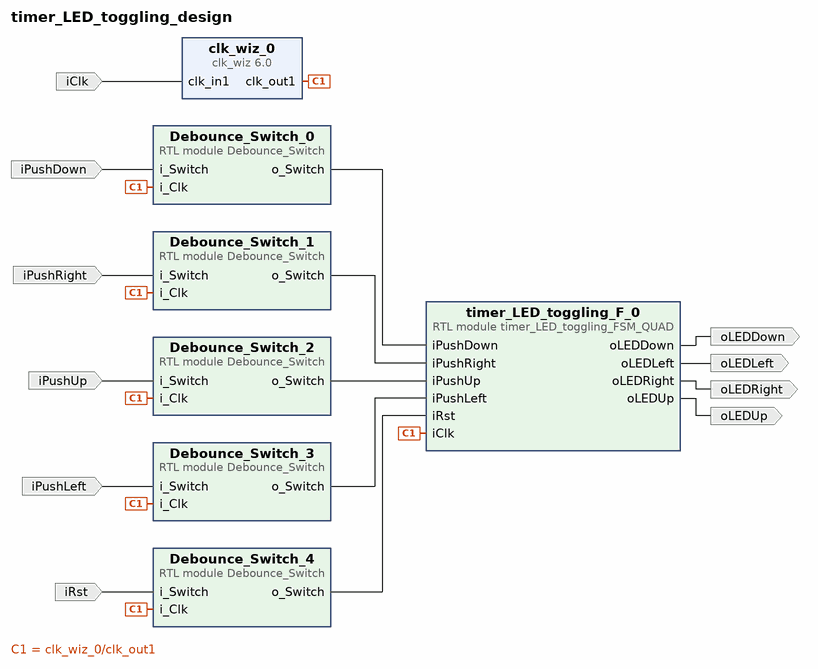
[diagram p0: block diagram of the top level]
# Vivado block design timer_LED_toggling_design, xc7z020clg400-1, Vivado 2025.1
create_bd_design timer_LED_toggling_design

create_bd_port -dir I -type clk iClk
create_bd_port -dir I iPushDown
create_bd_port -dir I iRst
create_bd_port -dir I iPushUp
create_bd_port -dir I iPushRight
create_bd_port -dir I iPushLeft
create_bd_port -dir O oLEDUp
create_bd_port -dir O oLEDDown
create_bd_port -dir O oLEDLeft
create_bd_port -dir O oLEDRight

create_bd_cell -type ip -vlnv xilinx.com:ip:clk_wiz:6.0 clk_wiz_0
set_property -dict [list \
  CONFIG.CLKIN1_JITTER_PS 80.0 \
  CONFIG.CLKOUT1_JITTER 312.659 \
  CONFIG.CLKOUT1_PHASE_ERROR 245.713 \
  CONFIG.CLKOUT1_REQUESTED_OUT_FREQ 25 \
  CONFIG.CLK_IN1_BOARD_INTERFACE sys_clock \
  CONFIG.MMCM_CLKFBOUT_MULT_F 36.500 \
  CONFIG.MMCM_CLKIN1_PERIOD 8.000 \
  CONFIG.MMCM_CLKOUT0_DIVIDE_F 36.500 \
  CONFIG.MMCM_DIVCLK_DIVIDE 5 \
  CONFIG.USE_LOCKED false \
  CONFIG.USE_RESET false \
] [get_bd_cells clk_wiz_0]
create_bd_cell -type module -reference Debounce_Switch Debounce_Switch_0
create_bd_cell -type module -reference Debounce_Switch Debounce_Switch_1
create_bd_cell -type module -reference Debounce_Switch Debounce_Switch_2
create_bd_cell -type module -reference Debounce_Switch Debounce_Switch_3
create_bd_cell -type module -reference timer_LED_toggling_FSM_QUAD timer_LED_toggling_F_0
create_bd_cell -type module -reference Debounce_Switch Debounce_Switch_4

# ---- connections ----

connect_bd_net [get_bd_pins Debounce_Switch_0/o_Switch] [get_bd_pins timer_LED_toggling_F_0/iPushDown]
connect_bd_net [get_bd_pins Debounce_Switch_1/o_Switch] [get_bd_pins timer_LED_toggling_F_0/iPushRight]
connect_bd_net [get_bd_pins Debounce_Switch_2/o_Switch] [get_bd_pins timer_LED_toggling_F_0/iPushUp]
connect_bd_net [get_bd_pins Debounce_Switch_3/o_Switch] [get_bd_pins timer_LED_toggling_F_0/iPushLeft]
connect_bd_net [get_bd_pins Debounce_Switch_4/o_Switch] [get_bd_pins timer_LED_toggling_F_0/iRst]
connect_bd_net [get_bd_pins clk_wiz_0/clk_out1] \
  [get_bd_pins Debounce_Switch_0/i_Clk] [get_bd_pins Debounce_Switch_1/i_Clk] [get_bd_pins Debounce_Switch_2/i_Clk] \
  [get_bd_pins Debounce_Switch_3/i_Clk] [get_bd_pins Debounce_Switch_4/i_Clk] [get_bd_pins timer_LED_toggling_F_0/iClk]
connect_bd_net [get_bd_ports iClk] [get_bd_pins clk_wiz_0/clk_in1]
connect_bd_net [get_bd_ports iRst] [get_bd_pins Debounce_Switch_4/i_Switch]
connect_bd_net -net i_Switch_0_1 [get_bd_ports iPushDown] [get_bd_pins Debounce_Switch_0/i_Switch]
connect_bd_net -net i_Switch_1_1 [get_bd_ports iPushUp] [get_bd_pins Debounce_Switch_2/i_Switch]
connect_bd_net -net i_Switch_2_1 [get_bd_ports iPushRight] [get_bd_pins Debounce_Switch_1/i_Switch]
connect_bd_net -net i_Switch_3_1 [get_bd_ports iPushLeft] [get_bd_pins Debounce_Switch_3/i_Switch]
connect_bd_net [get_bd_pins timer_LED_toggling_F_0/oLEDDown] [get_bd_ports oLEDDown]
connect_bd_net [get_bd_pins timer_LED_toggling_F_0/oLEDLeft] [get_bd_ports oLEDLeft]
connect_bd_net [get_bd_pins timer_LED_toggling_F_0/oLEDRight] [get_bd_ports oLEDRight]
connect_bd_net [get_bd_pins timer_LED_toggling_F_0/oLEDUp] [get_bd_ports oLEDUp]

validate_bd_design
save_bd_design
